# EAGLE design zerodetect (EAGLE 5.04)
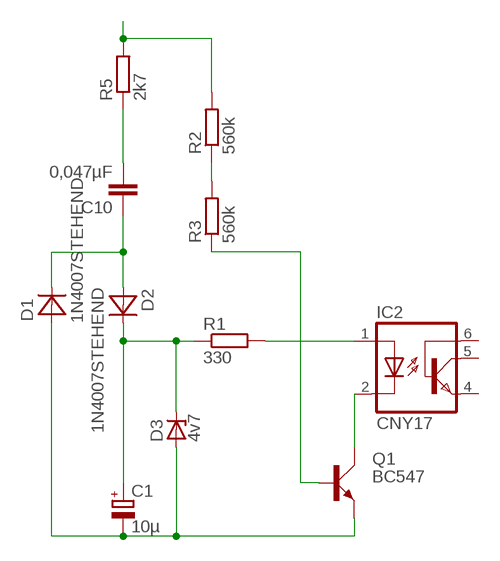
[diagram p0: schematic, sheet 1]

## Parts
C1  10µ  CPOL-EUE2-5  [E2-5]
C10  0,047µF  C-EU075-063X106  [C075-063X106]
D1  1N4007STEHEND  [RAD2,5]
D2  1N4007STEHEND  [RAD2,5]
D3  4v7  ZENER-DIODEZD-2.5  [ZDIO-2.5]
IC2  CNY17  [DIL06]
Q1  BC547  [SOT54A]
R1  330  R-EU_0207/2V  [0207/2V]
R2  560k  R-EU_0207/7  [0207/7]
R3  560k  R-EU_0204/7  [0204/7]
R5  2k7  R-EU_0207/2V  [0207/2V]

## Nets
N$1: C1.+ D2.C D3.C R1.1
N$2: C1.- D1.A D3.A Q1.E
N$3: C10.1 D1.C D2.A
N$4: IC2.1(A) R1.2
N$5: IC2.2(C) Q1.C
N$7: Q1.B R3.1
N$8: R2.1 R3.2
N$9: R2.2 R5.2
N$17: C10.2 R5.1
Unconnected: IC2.4(EMI) IC2.5(COL) IC2.6(BAS)

## Library data of the parts
C1 = rcl:CPOL-EU: POLARIZED CAPACITOR, European symbol
C10 = rcl:C-EU: CAPACITOR, European symbol
D1 D2 = diode:1N4007
D3 = diode:ZENER-DIODE: Z-Diode
IC2 = optocoupler:CNY17: SIEMENS OPTO COUPLER
Q1 = transistor-small-signal:BC547: NPN TRANSISTOR
R1-R3 R5 = rcl:R-EU_: RESISTOR, European symbol

## Board
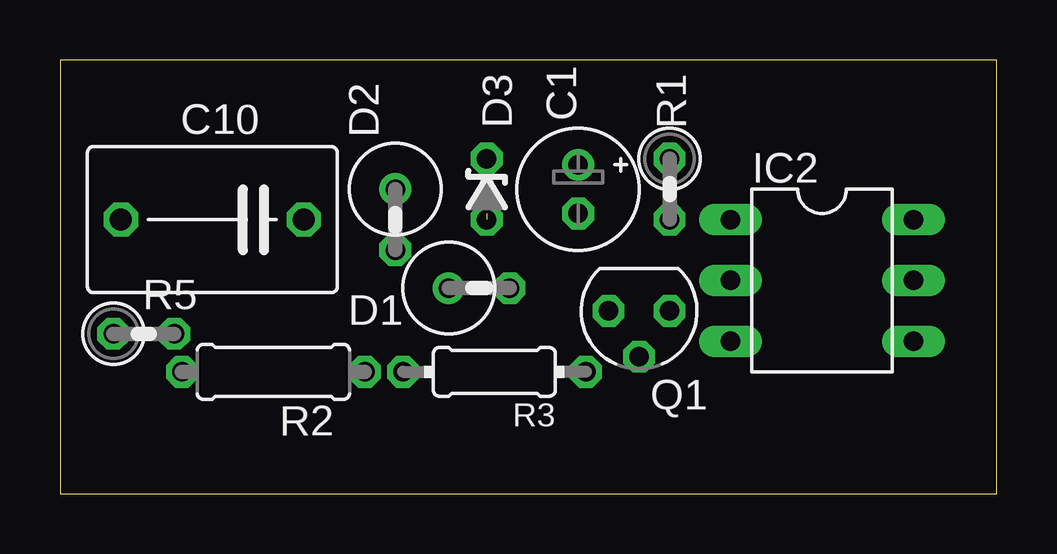
[diagram p1: board, top side]
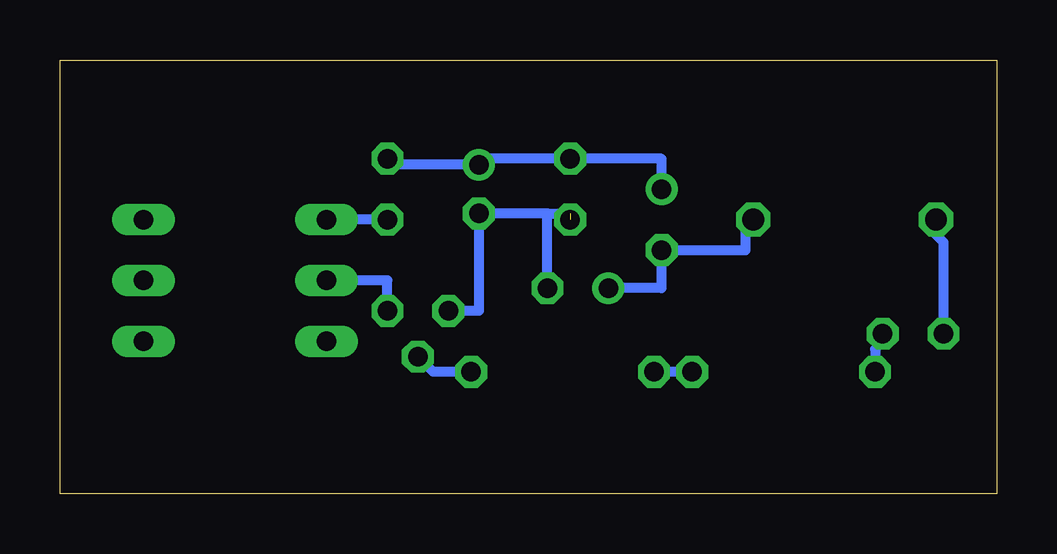
[diagram p2: board, bottom side, seen from below]

Size 39.04 x 18.09 mm. Coordinates in mm from the lower left corner, seen from the top.
Outline: 0,0 39.04,0 39.04,18.09 0,18.09 0,0
Copper layers (1*16): Top 0.035mm / dielectric 1.5mm / Bottom 0.035mm
Design rules "default": minimum track width 10mil, minimum drill 24mil, track to track 8mil, track to pad 8mil, pad to pad 8mil, via to via 8mil, smd to smd 8mil, copper to edge 40mil, drill to drill 8mil, minimum pad ring 10mil, minimum via ring 8mil, stop-mask expansion 4mil, vias tented up to drill 0mil, thermal gap 10mil

### Footprints (pad centres in the part's own frame; a part is rotated, then mirrored left to right if it is on the bottom)
E2-5 = drill 0.813 pad 1.27 round: + -1.016,0 | drill 0.813 pad 1.27 octagon: - 1.016,0
C075-063X106 = drill 0.914 octagon: 1 -3.81,0; 2 3.81,0
RAD2,5 = drill 0.813 octagon: A 1.27,0 | drill 0.813 round: C -1.27,0
ZDIO-2.5 = drill 0.813 octagon: A 1.27,0; C -1.27,0
DIL06 = drill 0.813 long: 1 -2.54,-3.81; 2 0,-3.81; 3 2.54,-3.81; 4 2.54,3.81; 5 0,3.81; 6 -2.54,3.81
SOT54A = drill 0.813 octagon: B 0,1.905; C -1.27,0; E 1.27,0
0207/2V = drill 0.813 octagon: 1 -1.27,0; 2 1.27,0
0207/7 = drill 0.813 octagon: 1 -3.81,0; 2 3.81,0
0204/7 = drill 0.813 octagon: 1 -3.81,0; 2 3.81,0

### Placement (x,y rotation side)
C1  21.59,12.7 270 top
C10  6.35,11.43 180 top
D1  17.46,8.57 0 top
D2  13.97,11.43 270 top
D3  17.78,12.7 270 top
IC2  31.75,8.89 270 top
Q1  24.13,7.62 180 top
R1  25.4,12.7 270 top
R2  8.89,5.08 180 top
R3  18.1,5.08 180 top
R5  3.49,6.67 0 top

### Tracks (layer width: path | path; a pad name or v marks a point on that pad's centre or on a via)
N$1
  Bottom 0.406: R1.1 25.4,13.72 C1.+ 21.59,13.97 D3.C 13.97,13.97 D2.C
N$2  (1 unrouted)
  Bottom 0.406: Q1.E 21.59,7.62 C1.- 18.73,11.68 | 18.73,11.68 17.78,11.68 | D1.A 18.73,11.68
N$3
  Bottom 0.406: D1.C 13.97,8.57 D2.A 10.48,10.16 10.48,11.43 C10.1
N$4
  Bottom 0.406: R1.2 IC2.1
N$5
  Bottom 0.406: Q1.C 25.4,8.89 IC2.2
N$7
  Bottom 0.406: R3.1 23.5,5.08 Q1.B
N$8
  Bottom 0.406: R2.1 R3.2
N$9
  Bottom 0.406: R5.2 4.76,6.35 5.08,6.03 R2.2
N$17
  Bottom 0.406: R5.1 2.22,10.48 2.54,10.79 C10.2